# Altium project Motherboard.PrjPcb
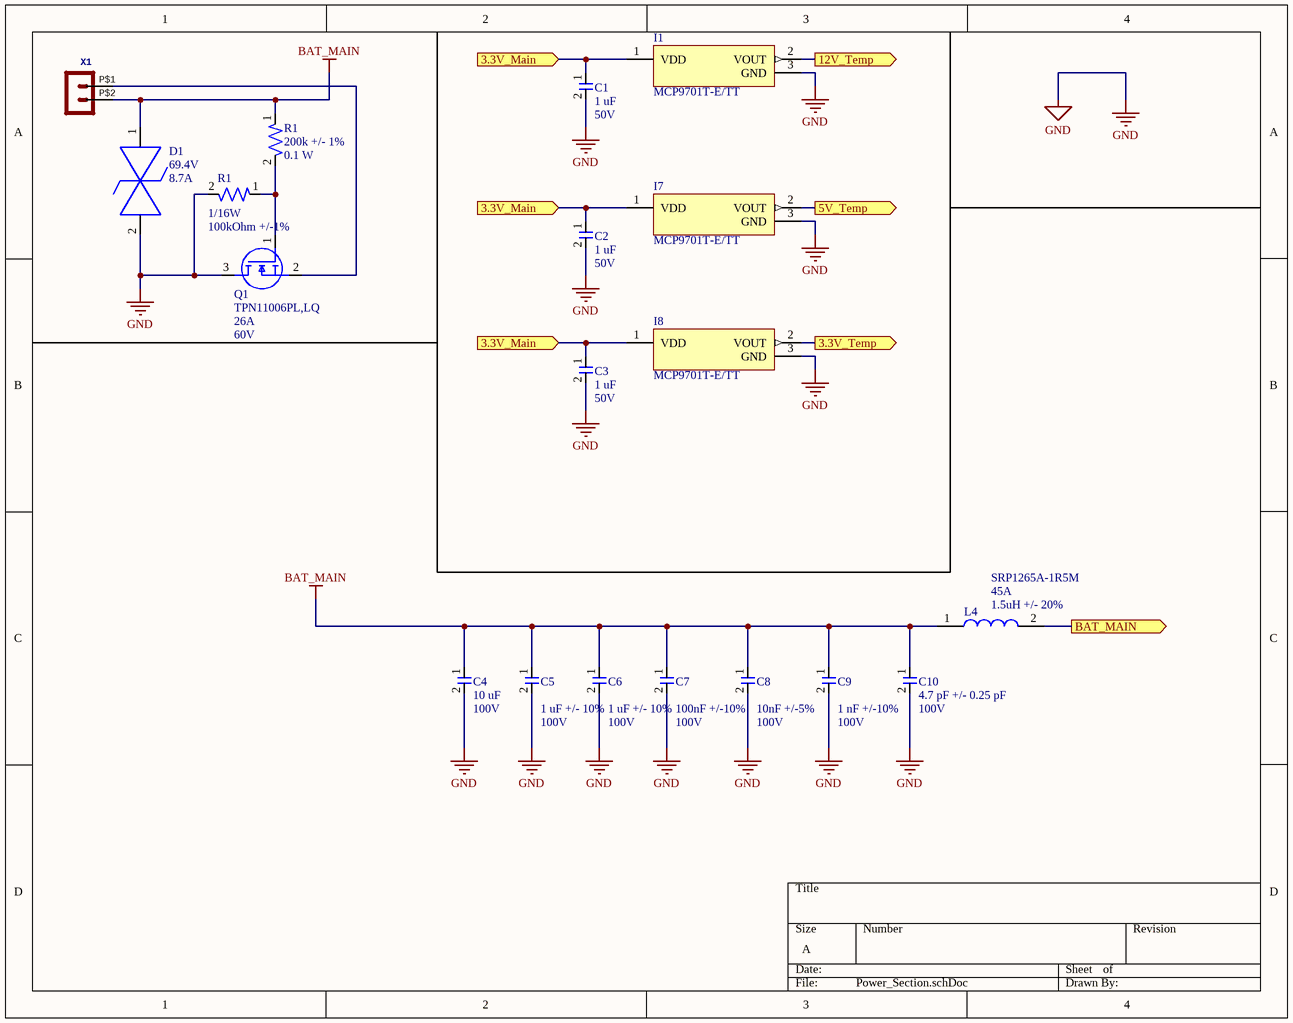
[diagram p0: Power_Section.schDoc]
3 sheets, 151 parts. Net scope: flat (ports and power ports of the same name join across sheets).
Board file: Motherboard.PcbDoc
Sheets:
  Power_Section.schDoc
  5V_12V_Converter.SchDoc
  Mosfet_Board.SchDoc

## Sheet Power_Section.schDoc
size A; SheetNumber: 1; SheetTotal: 8

### Parts
(Parts that share a designator on the sheet are numbered #1, #2 ... from top to bottom, then left to right.)
C1  Capacitance: 1 uF  Voltage: 50V  [CAP-0603]  (hidden comment: UMK107AB7105KA-T)
C2  Capacitance: 1 uF  Voltage: 50V  [CAP-0603]  (hidden comment: UMK107AB7105KA-T)
C3  Capacitance: 1 uF  Voltage: 50V  [CAP-0603]  (hidden comment: UMK107AB7105KA-T)
C4  Capcitance: 10 uF  Voltage Rating: 100V  [CAP-1210]  (hidden comment: GRM32EC72A106KE05L)
C5  Capacitance: 1 uF +/- 10%  Voltage: 100V  [CAP-1206 - duplicate]  (hidden comment: CAP-1U-0001)
C6  Capacitance: 1 uF +/- 10%  Voltage: 100V  [CAP-1206 - duplicate]  (hidden comment: CAP-1U-0001)
C7  Capacitance: 100nF +/-10%  Voltage Rating: 100V  [CAP-0603]  (hidden comment: CC0603KRX7R0BB104)
C8  Capacitance: 10nF +/-5%  Voltage Rating: 100V  [CAP-0603]  (hidden comment: C1608C0G2A103J080AC)
C9  Capacitance: 1 nF +/-10%  Voltage: 100V  [CAP-0603]  (hidden comment: CAP-1N-0001)
C10  Capacitance: 4.7 pF +/- 0.25 pF  Voltage: 100V  [CAP-0603]  (hidden comment: CC0603CRNPO0BN4R7)
D1  Vclamp: 69.4V  Peak pulser current: 8.7A  [DO-214AA (SMBJ)]  (hidden comment: SMBJE43CAH)
I1  MCP9701T-E/TT  [IC-TEMP-0001]
I7  MCP9701T-E/TT  [IC-TEMP-0001]
I8  MCP9701T-E/TT  [IC-TEMP-0001]
L4  SRP1265A-1R5M  Saturation Current: 45A  Inductance: 1.5uH +/- 20%  [PWRIND-1.5U-0002]
Q1  TPN11006PL,LQ  Id-Continuous: 26A  VDS-Max: 60V  [NMOS-8TSON]
R1#1  Resistance: 200k +/- 1%  Power Rating: 0.1 W  [RES-0603]  (hidden comment: ERJ-3EKF2003V)
R1#2  Power Rating: 1/16W  Resistance: 100kOhm +/-1%  [RES-0402]  (hidden comment: AF0402FR-07100KL)
X1  Molex - Micro-Fit 3.0 Series connector,  3.00mm (0.118") pitch header, 2 positions.  [43045-0200]  (value not drawn)

### Ports
3.3V_Main (in), 3.3V_Temp (out), 5V_Temp (out), 12V_Temp (out), BAT_MAIN (out)

### Nets
BAT_MAIN: C4.1 C5.1 C6.1 C7.1 C8.1 C9.1 C10.1 D1.1 L4.1 L4.2 R1#1.1 X1.P$2 ; port BAT_MAIN
GND: C1.2 C2.2 C3.2 C4.2 C5.2 C6.2 C7.2 C8.2 C9.2 C10.2 D1.2 I1.3(GND) I7.3(GND) I8.3(GND) Q1.3(D) R1#2.2
NetC1_1: C1.1 C2.1 C3.1 I1.1(VDD) I7.1(VDD) I8.1(VDD) ; port 3.3V_Main
NetI1_2: I1.2(VOUT) ; port 12V_Temp
NetI7_2: I7.2(VOUT) ; port 5V_Temp
NetI8_2: I8.2(VOUT) ; port 3.3V_Temp
NetQ1_1: Q1.1(G) R1#1.2 R1#2.1
NetQ1_2: Q1.2(S) X1.P$1

### Library data of the parts
C1-C3 = CAP-1U-0002: 1 µF ±10% 50V Ceramic Capacitor X7R 0603 (1608 Metric); Package Size: 0603
C4 = CAP-10U-0003: 10 µF ±10% 100V Ceramic Capacitor X7S 1210 (3225 Metric); Package Size: 1210
C5 C6 = CAP-1U-0001: 1 µF ±10% 100V Ceramic Capacitor X7R 1206 (3216 Metric)
C7 = CAP-100N-0001: CAP CER 0.1UF 100V X7R 0603; Manufacturer: YAGEO; Assembled?: no; Manufacturer Part Number: CC0603KRX7R0BB104; Temperature Coefficient: X7R; Package Size: 0603
C8 = CAP-10N-0002: CAP CER 10000PF 100V C0G 0603; Manufacturer: TDK Corporation; Temperature Coefficient: C0G/NP0; Assembled?: no; Manufacturer Part Number: C1608C0G2A103J080AC; Package Size: 0603
C9 = CAP-1N-0001: 1000 pF ±10% 100V Ceramic Capacitor X7R 0603 (1608 Metric)
C10 = CAP-4.7P-0002: 4.7 pF ±0.25pF 100V Ceramic Capacitor C0G, NP0 0603 (1608 Metric)
D1 = DIO-69.4V-0001: 69.4V Clamp 8.7A Ipp Tvs Diode Surface Mount DO-214AA (SMBJ); Channels: Bidirectional; Breakdown VOltage: 47.8V; Reverse working maximum voltage: 43V; Package: DO-214AA (SMBJ)
I1 I7 I8 = IC-TEMP-0001: Temperature Sensor Analog, Local -10°C ~ 125°C 19.5mV/°C SOT-23-3; Manufacturer: Microchip Technology; Assembled?: no; VCC-Max: 5.5V; VCC-Min: 3.3V; Manufacturer Part Number: MCP9701T-E/TT; Package: SOT-23-3
L4 = PWRIND-1.5U-0002: 1.5 µH Shielded Drum Core, Wirewound Inductor 27 A 3mOhm Max Nonstandard; Manufacturer: Bourns Electronics; Type: DEV; DC Resistnace: 3.0mOhm max; Copyright: Copyright (C) 2022 Ultra Librarian. All rights reserved.; Manufacturer Part Number: SRP1265A-1R5M; Dimensions: 12.5x13.5x6.2
Q1 = NMOS-26A-0001: N-Channel 60 V 26A (Tc) 610mW (Ta), 61W (Tc) Surface Mount 8-TSON Advance (3.1x3.1); Manufacturer: Toshiba; Rds On-Max: 18.1mOhm; Vgs-Max: 20V; Assembled?: no; Manufacturer Part Number: TPN11006PL,LQ; FET type: N-Channel; Package: 8-TSON Advance
R1#1 = RES-200K-0001: 200 kOhms ±1% 0.1W, 1/10W Chip Resistor 0603 (1608 Metric) Automotive AEC-Q200 Thick Film; Manufacturer: Panasonic Electronic Components; Assembled?: Yes; MFP: ERJ-3EKF2003V; Package SIze: 0603
R1#2 = RES-100K-0001: 100 kOhms ±1% 0.063W, 1/16W Chip Resistor 0402 (1005 Metric) Anti-Sulfur, Automotive AEC-Q200 Thick Film; Manufacturer: YAGEO; Assembled?: no; Manufacturer Part Number: AF0402FR-07100KL; Package Size: 0402
X1 = HEADER_POS2_?43045-0200: GateName_1: G$1; SymbolName_1: HEADER_POS2; DeviceName: 43045-0200; LibraryName: con-molex-micro-fit-3_0_2; DeviceSetName: HEADER_POS2_?; Package: 43045-0200

## Sheet 5V_12V_Converter.SchDoc
size B; SheetNumber: 3; SheetTotal: 8
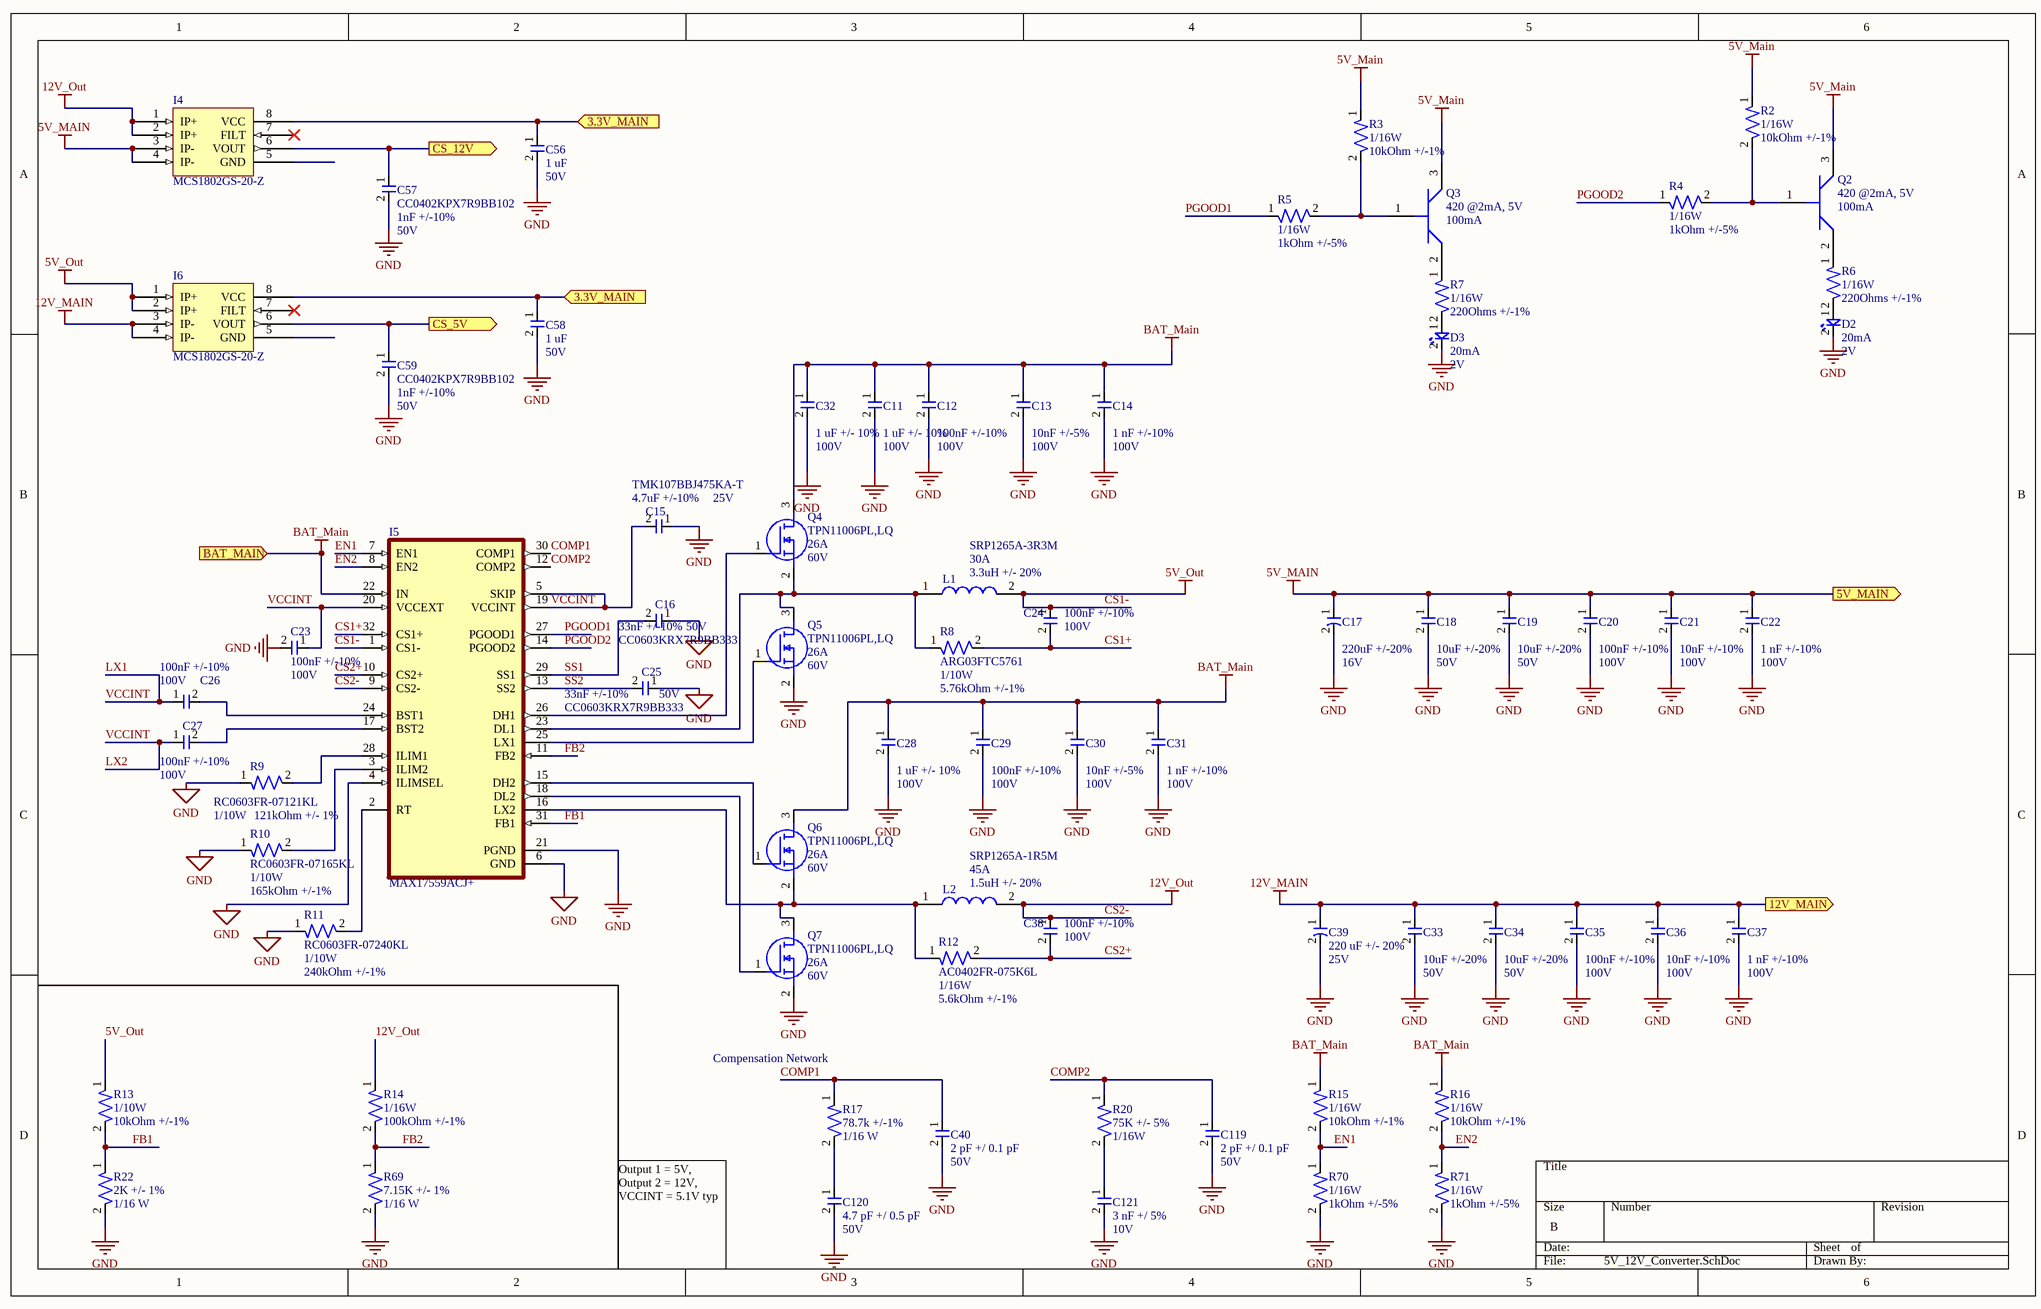
[diagram p1: 5V_12V_Converter.SchDoc]

### Parts
C11  Capacitance: 1 uF +/- 10%  Voltage: 100V  [CAP-1206 - duplicate]  (hidden comment: CAP-1U-0001)
C12  Capacitance: 100nF +/-10%  Voltage Rating: 100V  [CAP-0603]  (hidden comment: CC0603KRX7R0BB104)
C13  Capacitance: 10nF +/-5%  Voltage Rating: 100V  [CAP-0603]  (hidden comment: C1608C0G2A103J080AC)
C14  Capacitance: 1 nF +/-10%  Voltage: 100V  [CAP-0603]  (hidden comment: CAP-1N-0001)
C15  TMK107BBJ475KA-T  Capacitance: 4.7uF +/-10%  Voltage Rating: 25V  [CAP-0603]
C16  CC0603KRX7R9BB333  Capacitance: 33nF +/-10%  Voltage Rating: 50V  [CAP-0603]
C17  Capacitance: 220uF +/-20%  Voltage Rating: 16V  [ELEC-220U-0001]  (hidden comment: UUD1C221MCL1GS)
C18  Capacitance: 10uF +/-20%  Voltage Rating: 50V  [CAP-1206]  (hidden comment: CL31B106KBHNNNE)
C19  Capacitance: 10uF +/-20%  Voltage Rating: 50V  [CAP-1206]  (hidden comment: CL31B106KBHNNNE)
C20  Capacitance: 100nF +/-10%  Voltage Rating: 100V  [CAP-0603]  (hidden comment: CC0603KRX7R0BB104)
C21  Capacitance: 10nF +/-10%  Voltage Rating: 100V  [CAP-0402]  (hidden comment: CC0402KRX7R0BB103)
C22  Capacitance: 1 nF +/-10%  Voltage: 100V  [CAP-0603]  (hidden comment: CAP-1N-0001)
C23  Capacitance: 100nF +/-10%  Voltage Rating: 100V  [CAP-0603]  (hidden comment: CC0603KRX7R0BB104)
C24  Capacitance: 100nF +/-10%  Voltage Rating: 100V  [CAP-0603]  (hidden comment: CC0603KRX7R0BB104)
C25  CC0603KRX7R9BB333  Capacitance: 33nF +/-10%  Voltage Rating: 50V  [CAP-0603]
C26  Capacitance: 100nF +/-10%  Voltage Rating: 100V  [CAP-0603]  (hidden comment: CC0603KRX7R0BB104)
C27  Capacitance: 100nF +/-10%  Voltage Rating: 100V  [CAP-0603]  (hidden comment: CC0603KRX7R0BB104)
C28  Capacitance: 1 uF +/- 10%  Voltage: 100V  [CAP-1206 - duplicate]  (hidden comment: CAP-1U-0001)
C29  Capacitance: 100nF +/-10%  Voltage Rating: 100V  [CAP-0603]  (hidden comment: CC0603KRX7R0BB104)
C30  Capacitance: 10nF +/-5%  Voltage Rating: 100V  [CAP-0603]  (hidden comment: C1608C0G2A103J080AC)
C31  Capacitance: 1 nF +/-10%  Voltage: 100V  [CAP-0603]  (hidden comment: CAP-1N-0001)
C32  Capacitance: 1 uF +/- 10%  Voltage: 100V  [CAP-1206 - duplicate]  (hidden comment: CAP-1U-0001)
C33  Capacitance: 10uF +/-20%  Voltage Rating: 50V  [CAP-1206]  (hidden comment: CL31B106KBHNNNE)
C34  Capacitance: 10uF +/-20%  Voltage Rating: 50V  [CAP-1206]  (hidden comment: CL31B106KBHNNNE)
C35  Capacitance: 100nF +/-10%  Voltage Rating: 100V  [CAP-0603]  (hidden comment: CC0603KRX7R0BB104)
C36  Capacitance: 10nF +/-10%  Voltage Rating: 100V  [CAP-0402]  (hidden comment: CC0402KRX7R0BB103)
C37  Capacitance: 1 nF +/-10%  Voltage: 100V  [CAP-0603]  (hidden comment: CAP-1N-0001)
C38  Capacitance: 100nF +/-10%  Voltage Rating: 100V  [CAP-0603]  (hidden comment: CC0603KRX7R0BB104)
C39  Capacitance: 220 uF +/- 20%  Voltage: 25V  [ELEC-220U-0002]  (hidden comment: 25THV220M8X10.5)
C40  Capacitance: 2 pF +/ 0.1 pF  Voltage: 50V  [CAP-0402]  (hidden comment: CC0402BRNPO9BN2R0)
C56  Capacitance: 1 uF  Voltage: 50V  [CAP-0603]  (hidden comment: UMK107AB7105KA-T)
C57  CC0402KPX7R9BB102  Capacitance: 1nF +/-10%  Voltage Rating: 50V  [CAP-0402]
C58  Capacitance: 1 uF  Voltage: 50V  [CAP-0603]  (hidden comment: UMK107AB7105KA-T)
C59  CC0402KPX7R9BB102  Capacitance: 1nF +/-10%  Voltage Rating: 50V  [CAP-0402]
C119  Capacitance: 2 pF +/ 0.1 pF  Voltage: 50V  [CAP-0402]  (hidden comment: CC0402BRNPO9BN2R0)
C120  Capacitance: 4.7 pF +/ 0.5 pF  Voltage Rating: 50V  [CAP-0603]  (hidden comment: 06035A4R7DAT2A)
C121  Capacitance: 3 nF +/ 5%  Voltagev: 10V  [CAP-0402]  (hidden comment: GRM1557U1A302JA01D)
D2  Current Rating: 20mA  Vf: 2V  [LED-0603]  (hidden comment: 150060AS75000)
D3  Current Rating: 20mA  Vf: 2V  [LED-0603]  (hidden comment: 150060AS75000)
I4  MCS1802GS-20-Z  [IC-BUCK-8SOIC]
I5  MAX17559ACJ+  [IC-BUCK-TQFP-7x7]
I6  MCS1802GS-20-Z  [IC-BUCK-8SOIC]
L1  SRP1265A-3R3M  Saturation Current: 30A  Inductance: 3.3uH +/- 20%  [PWRIND-3.3U-0002]
L2  SRP1265A-1R5M  Saturation Current: 45A  Inductance: 1.5uH +/- 20%  [PWRIND-1.5U-0002]
Q2  hFE: 420 @2mA, 5V  Ic: 100mA  [NPN-420-0001]  (hidden comment: BC847C,235)
Q3  hFE: 420 @2mA, 5V  Ic: 100mA  [NPN-420-0001]  (hidden comment: BC847C,235)
Q4  TPN11006PL,LQ  Id-Continuous: 26A  VDS-Max: 60V  [NMOS-8TSON]
Q5  TPN11006PL,LQ  Id-Continuous: 26A  VDS-Max: 60V  [NMOS-8TSON]
Q6  TPN11006PL,LQ  Id-Continuous: 26A  VDS-Max: 60V  [NMOS-8TSON]
Q7  TPN11006PL,LQ  Id-Continuous: 26A  VDS-Max: 60V  [NMOS-8TSON]
R2  Power Rating: 1/16W  Resistance: 10kOhm +/-1%  [RES-0402]  (hidden comment: RC0402FR-0710KL)
R3  Power Rating: 1/16W  Resistance: 10kOhm +/-1%  [RES-0402]  (hidden comment: RC0402FR-0710KL)
R4  Power Rating: 1/16W  Resistance: 1kOhm +/-5%  [RES-0402]  (hidden comment: RC0402JR-071KP)
R5  Power Rating: 1/16W  Resistance: 1kOhm +/-5%  [RES-0402]  (hidden comment: RC0402JR-071KP)
R6  Power Rating: 1/16W  Resistance: 220Ohms +/-1%  [RES-0402]  (hidden comment: AC0402FR-07220RL)
R7  Power Rating: 1/16W  Resistance: 220Ohms +/-1%  [RES-0402]  (hidden comment: AC0402FR-07220RL)
R8  ARG03FTC5761  Power Rating: 1/10W  Resistance: 5.76kOhm +/-1%  [RES-0603]
R9  RC0603FR-07121KL  Power Rating: 1/10W  Resistance: 121kOhm +/- 1%  [RES-0603]
R10  RC0603FR-07165KL  Power Rating: 1/10W  Resistance: 165kOhm +/-1%  [RES-0603]
R11  RC0603FR-07240KL  Power Rating: 1/10W  Resistance: 240kOhm +/-1%  [RES-0603]
R12  AC0402FR-075K6L  Power Rating: 1/16W  Resistance: 5.6kOhm +/-1%  [RES-0402]
R13  Power Rating: 1/10W  Resistance: 10kOhm +/-1%  [RES-0603]  (hidden comment: RC0603FR-0710KP)
R14  Power Rating: 1/16W  Resistance: 100kOhm +/-1%  [RES-0402]  (hidden comment: AF0402FR-07100KL)
R15  Power Rating: 1/16W  Resistance: 10kOhm +/-1%  [RES-0402]  (hidden comment: RC0402FR-0710KL)
R16  Power Rating: 1/16W  Resistance: 10kOhm +/-1%  [RES-0402]  (hidden comment: RC0402FR-0710KL)
R17  Resistance: 78.7k +/-1%  Power: 1/16 W  [RES-0402]  (hidden comment: RMCF0402FT78K7)
R20  Resistance: 75K +/- 5%  Power: 1/16W  [RES-0402]  (hidden comment: RMCF0402JT75K0)
R22  Resistance: 2K +/- 1%  Power: 1/16 W  [RES-0402]  (hidden comment: RC0402FR-072KP)
R69  Resistance: 7.15K +/- 1%  Power: 1/16 W  [RES-0402]  (hidden comment: CRCW04027K15FKED)
R70  Power Rating: 1/16W  Resistance: 1kOhm +/-5%  [RES-0402]  (hidden comment: RC0402JR-071KP)
R71  Power Rating: 1/16W  Resistance: 1kOhm +/-5%  [RES-0402]  (hidden comment: RC0402JR-071KP)

### Ports
3.3V_MAIN (in), 5V_MAIN (out), 12V_MAIN (out), BAT_MAIN (in), CS_5V (out), CS_12V (out)

### Nets
5V_MAIN: C17.1 C18.1 C19.1 C20.1 C21.1 C22.1 I4.3(IP-) I4.4(IP-) Q2.3 Q3.3 R2.1 R3.1 ; port 5V_MAIN
5V_Out: C24.1 I5.1(CS1-) I6.1(IP+) I6.2(IP+) L1.2 R13.1  [also labelled CS1-]
12V_MAIN: C33.1 C34.1 C35.1 C36.1 C37.1 C39.1 I6.3(IP-) I6.4(IP-) ; port 12V_MAIN
12V_Out: C38.1 I4.1(IP+) I4.2(IP+) I5.9(CS2-) L2.2 R14.1  [also labelled CS2-]
BAT_MAIN: C11.1 C12.1 C13.1 C14.1 C28.1 C29.1 C30.1 C31.1 C32.1 I5.22(IN) Q4.3(D) Q6.3(D) R15.1 R16.1 ; port BAT_MAIN
GND: C11.2 C12.2 C13.2 C14.2 C15.1 C16.1 C17.2 C18.2 C19.2 C20.2 C21.2 C22.2 C23.2 C25.1 C28.2 C29.2 C30.2 C31.2 C32.2 C33.2 C34.2 C35.2 C36.2 C37.2 C39.2 C40.2 C56.2 C57.2 C58.2 C59.2 C119.2 C120.2 C121.2 D2.2 D3.2 I5.4(ILIMSEL) I5.6(GND) I5.21(PGND) Q5.2(S) Q7.2(S) R9.1 R10.1 R11.1 R22.2 R69.2 R70.2 R71.2
COMP1: C40.1 I5.30(COMP1) R17.1
COMP2: C119.1 I5.12(COMP2) R20.1
CS1+: C24.2 I5.32(CS1+) R8.2
CS2+: C38.2 I5.10(CS2+) R12.2
EN1: I5.7(EN1) R15.2 R70.1
EN2: I5.8(EN2) R16.2 R71.1
FB1: I5.31(FB1) R13.2 R22.1
FB2: I5.11(FB2) R14.2 R69.1
LX1: C15.2 C23.1 C26.1 C27.1 I5.5(SKIP) I5.19(VCCINT) I5.20(VCCEXT)  [also labelled LX2, VCCINT]
PGOOD1: I5.27(PGOOD1) R5.1
PGOOD2: I5.14(PGOOD2) R4.1
SS1: C16.2 I5.29(SS1)
SS2: C25.2 I5.13(SS2)
NetC1_1: C56.1 C58.1 I4.8(VCC) I6.8(VCC) ; port 3.3V_MAIN
NetC26_2: C26.2 I5.24(BST1)
NetC27_2: C27.2 I5.17(BST2)
NetC57_1: C57.1 I4.6(VOUT) ; port CS_12V
NetC59_1: C59.1 I6.6(VOUT) ; port CS_5V
NetC120_1: C120.1 R17.2
NetC121_1: C121.1 R20.2
NetD2_1: D2.1 R6.2
NetD3_1: D3.1 R7.2
NetI5_2: I5.2(RT) R11.2
NetI5_3: I5.3(ILIM2) R10.2
NetI5_15: I5.15(DH2) Q6.1(G)
NetI5_16: I5.16(LX2) L2.1 Q6.2(S) Q7.3(D) R12.1
NetI5_18: I5.18(DL2) Q7.1(G)
NetI5_23: I5.23(DL1) L1.1 Q4.2(S) Q5.3(D) R8.1
NetI5_25: I5.25(LX1) Q5.1(G)
NetI5_26: I5.26(DH1) Q4.1(G)
NetI5_28: I5.28(ILIM1) R9.2
NetQ2_1: Q2.1 R2.2 R4.2
NetQ2_2: Q2.2 R6.1
NetQ3_1: Q3.1 R3.2 R5.2
NetQ3_2: Q3.2 R7.1

Not connected (* = marked no-connect by the designer): I4 5(GND) 7(FILT)*; I6 5(GND) 7(FILT)*

### Notes on the sheet
- (near R17) Compensation Network
- Output 1 = 5V,   Output 2 = 12V, VCCINT = 5.1V typ

### Library data of the parts
C11 C28 C32 = CAP-1U-0001: as C5 on sheet Power_Section
C12 C20 C23 C24 C26 C27 C29 C35 C38 = CAP-100N-0001: as C7 on sheet Power_Section; Manufacturer Part Number: CC0603KRX7R0BB104; Temperature Coefficient: X7R; Package Size: 0603
C13 C30 = CAP-10N-0002: as C8 on sheet Power_Section; Manufacturer Part Number: C1608C0G2A103J080AC; Package Size: 0603
C14 C22 C31 C37 = CAP-1N-0001: as C9 on sheet Power_Section
C15 = CAP-4.7U-0001: 4.7 µF ±10% 25V Ceramic Capacitor X5R 0603 (1608 Metric); Manufacturer: Taiyo Yuden; Assembled?: no; Manufacturer Part Number: TMK107BBJ475KA-T; Temperature Coefficient: X5R; Package Size: 0603
C16 C25 = CAP-33N-0001: 0.033 µF ±10% 50V Ceramic Capacitor X7R 0603 (1608 Metric); Manufacturer: YAGEO; Assembled?: no; Manufacturer Part Number: CC0603KRX7R9BB333; Temperature Coefficient: X7R; Package Size: 0603
C17 = ELEC-220U-0001: 220 µF 16 V Aluminum Electrolytic Capacitors Radial, Can - SMD 2000 Hrs @ 105°C; Manufacturer: Nichicon; Assembled?: no; Manufacturer Part Number: UUD1C221MCL1GS
C18 C19 C33 C34 = CAP-10U-0001: 10 µF ±10% 50V Ceramic Capacitor X7R 1206 (3216 Metric); Manufacturer: Samsung Electro-Mechanics; Assembled?: no; Manufacturer Part Number: CL31B106KBHNNNE; Temperature Coefficient: X7R; Package Size: 1206
C21 C36 = CAP-10N-0001: 10000 pF ±10% 100V Ceramic Capacitor X7R 0402 (1005 Metric); Manufacturer: YAGEO; Assembled?: no; Manufacturer Part Number: CC0402KRX7R0BB103; Temperature Coefficient: X7R; Package Size: 0402
C39 = ELEC-220U-0002: 220 µF 25 V Aluminum Electrolytic Capacitors Radial, Can - SMD 300mOhm @ 100kHz 3000 Hrs @ 125°C; SIze: 0.327 in x 0.327 in
C40 C119 = CAP-2P-0001: 2 pF ±0.1pF 50V Ceramic Capacitor C0G, NP0 0402 (1005 Metric)
C56 C58 = CAP-1U-0002: as C1 on sheet Power_Section; Package Size: 0603
C57 C59 = CAP-1N-0002: 1000 pF ±10% 50V Ceramic Capacitor X7R 0402 (1005 Metric); Manufacturer: YAGEO; Assembled?: no; Manufacturer Part Number: CC0402KPX7R9BB102; Temperature Coefficient: X7R; Package Size: 0402
C120 = CAP-4.7P-0001: 4.7 pF ±0.5pF 50V Ceramic Capacitor C0G, NP0 0603 (1608 Metric); Manufacturer: KYOCERA AVX; Temperature Coefficient: G0G. NP0; Assembled?: Yes; Manufacturer Part Number: 06035A4R7DAT2A; Package Size: 0603
C121 = CAP-3N-0001: 3000 pF ±5% 10V Ceramic Capacitor U2J 0402 (1005 Metric)
D2 D3 = LED_Amber_0001: CAP CER 0.1UF 100V X7R 0603; Manufacturer: Wurth Electronik; Assembled?: no; Color: Amber; Manufacturer Part Number: 150060AS75000; Package Size: 0603
I4 I6 = IC-CURRENT-0002: Current Sensor ±20A 1 Channel Hall Effect Bidirectional 8-SOIC (0.154", 3.90mm Width); Manufacturer Part Number: MCS1802GS-20-Z
I5 = IC-BUCK-0005: Buck Regulator Positive Output Step-Down - DC-DC Controller IC 32-TQFP (7x7); MF: Maxim Integrated; SnapEDA_Link: https://www.snapeda.com/parts/MAX17559ACJ+/Maxim+Integrated/view-part/?ref=snap; MP: MAX17559ACJ+; Package: TQFP-32 Maxim; Check_prices: https://www.snapeda.com/parts/MAX17559ACJ+/Maxim+Integrated/view-part/?ref=eda; Value: *; Purchase-URL: https://pricing.snapeda.com/search/part/MAX17559ACJ+/?ref=eda; Digi-Key_Part_Number: MAX17559ACJ+T-ND
L1 = PWRIND-3.3U-0002: 3.3 µH Shielded Drum Core, Wirewound Inductor 18 A 6.8mOhm Max Nonstandard; Manufacturer: Bourns Electronics; Type: DEV; Copyright: Copyright (C) 2022 Ultra Librarian. All rights reserved.; Manufacturer Part Number: SRP1265A-3R3M; Dimensions: 12.5x13.5x6.2; DC Resistance: 6.8mOhm max
L2 = PWRIND-1.5U-0002: as L4 on sheet Power_Section; Copyright: Copyright (C) 2022 Ultra Librarian. All rights reserved.; Manufacturer Part Number: SRP1265A-1R5M; Dimensions: 12.5x13.5x6.2
Q2 Q3 = BJT-420-0001: Bipolar (BJT) Transistor NPN 45 V 100 mA 100MHz 250 mW Surface Mount TO-236AB; VCEO: 45V; Transistor type: NPN; Package: TO-236AB
Q4-Q7 = NMOS-26A-0001: as Q1 on sheet Power_Section; Manufacturer Part Number: TPN11006PL,LQ; FET type: N-Channel; Package: 8-TSON Advance
R2 R3 R15 R16 = RES-10K-0001: RES 10K OHM 1% 1/16W 0402; Manufacturer: YAGEO; Assembled?: no; Manufacturer Part Number: RC0402FR-0710KL; Package Size: 0402
R4 R5 R70 R71 = RES-1K-0001: RES SMD 1K OHM 5% 1/16W 0402; Manufacturer: YAGEO; Assembled?: no; Manufacturer Part Number: RC0402JR-071KP; Package Size: 0402
R6 R7 = RES-220-0001: 220 Ohms ±1% 0.063W, 1/16W Chip Resistor 0402 (1005 Metric) Automotive AEC-Q200, Moisture Resistant Thick Film; Manufacturer: YAGEO; Assembled?: no; Manufacturer Part Number: AC0402FR-07220RL; Package Size: 0402
R8 = RES-5.76K-0001: 100mW Thin Film Resistor 75V ±25ppm/℃ ±1% -55℃~+155℃ 5.76kΩ 0603 Chip Resistor - Surface Mount ROHS; Manufacturer: Viking Tech; Assembled?: no; Manufacturer Part Number: ARG03FTC5761; Package Size: 0603
R9 = RES-121K-0001: 121k Ohms ±1% 0.1W, 1/10W Chip Resistor 0603 (1608 Metric) Moisture Resistant Thick Film; Manufacturer: YAGEO; Assembled?: no; Manufacturer Part Number: RC0603FR-07121KL; Package Size: 0603
R10 = RES-165K-0001: 165k Ohms ±1% 0.1W, 1/10W Chip Resistor 0603 (1608 Metric) Moisture Resistant Thick Film; Manufacturer: YAGEO; Assembled?: no; Manufacturer Part Number: RC0603FR-07165KL; Package Size: 0603
R11 = RES-240K-0001: 240k Ohms ±1% 0.1W, 1/10W Chip Resistor 0603 (1608 Metric) Moisture Resistant Thick Film; Manufacturer: YAGEO; Assembled?: no; Manufacturer Part Number: RC0603FR-07240KL; Package Size: 0603
R12 = RES-5.6K-0001: 5.6 kOhms ±1% 0.063W, 1/16W Chip Resistor 0402 (1005 Metric) Automotive AEC-Q200, Moisture Resistant Thick Film; Manufacturer: YAGEO; Assembled?: no; Manufacturer Part Number: AC0402FR-075K6L; Package Size: 0402
R13 = RES-10K-0002: RES SMD 10K OHM 1% 1/10W 0603; Manufacturer: YAGEO; Assembled?: no; Manufacturer Part Number: RC0603FR-0710KP; Package Size: 0603
R14 = RES-100K-0001: as R1#2 on sheet Power_Section; Manufacturer Part Number: AF0402FR-07100KL; Package Size: 0402
R17 = RES-78.7K-0001: 78.7 kOhms ±1% 0.063W, 1/16W Chip Resistor 0402 (1005 Metric) Automotive AEC-Q200 Thick Film
R20 = RES-75K-0001: 75 kOhms ±5% 0.063W, 1/16W Chip Resistor 0402 (1005 Metric) Automotive AEC-Q200 Thick Film
R22 = RES-2K-0001: 2 kOhms ±1% 0.063W, 1/16W Chip Resistor 0402 (1005 Metric) Thick Film
R69 = RES-7K-0001: 7.15 kOhms ±1% 0.063W, 1/16W Chip Resistor 0402 (1005 Metric) Automotive AEC-Q200 Thick Film

## Sheet Mosfet_Board.SchDoc
size A4; SheetNumber: 5; SheetTotal: 8
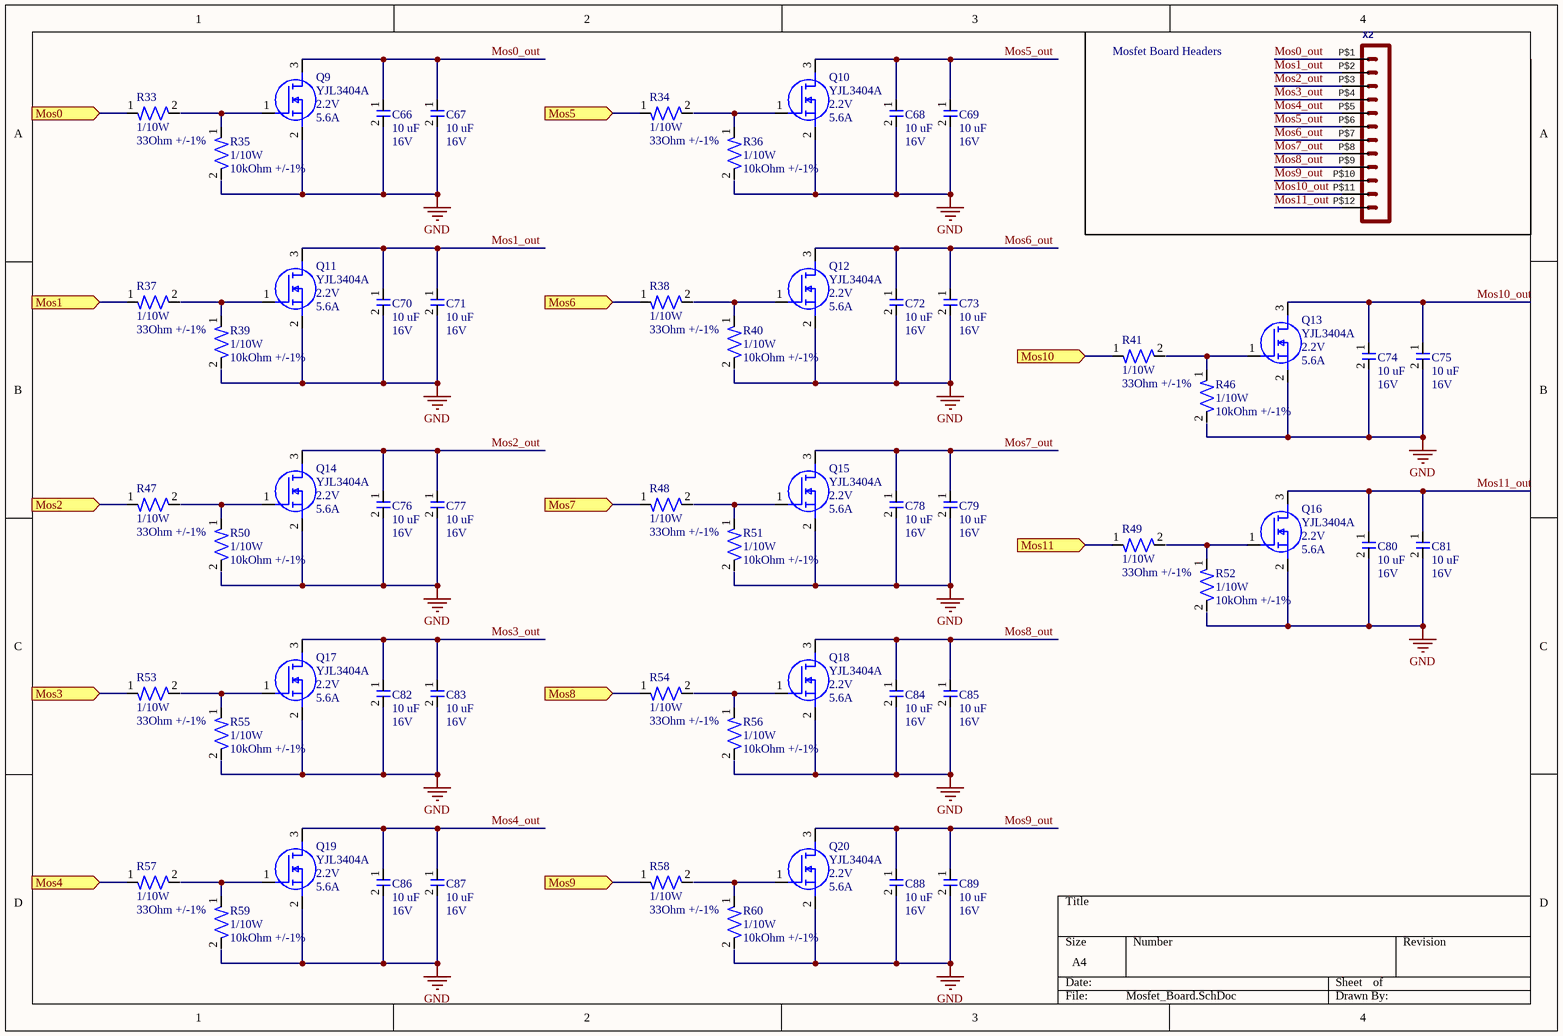
[diagram p2: Mosfet_Board.SchDoc]

### Parts
C66  Capacitance: 10 uF  Voltage Rating: 16V  [CAP-0805]  (hidden comment: MCS1802GS-20-Z)
C67  Capacitance: 10 uF  Voltage Rating: 16V  [CAP-0805]  (hidden comment: MCS1802GS-20-Z)
C68  Capacitance: 10 uF  Voltage Rating: 16V  [CAP-0805]  (hidden comment: MCS1802GS-20-Z)
C69  Capacitance: 10 uF  Voltage Rating: 16V  [CAP-0805]  (hidden comment: MCS1802GS-20-Z)
C70  Capacitance: 10 uF  Voltage Rating: 16V  [CAP-0805]  (hidden comment: MCS1802GS-20-Z)
C71  Capacitance: 10 uF  Voltage Rating: 16V  [CAP-0805]  (hidden comment: MCS1802GS-20-Z)
C72  Capacitance: 10 uF  Voltage Rating: 16V  [CAP-0805]  (hidden comment: MCS1802GS-20-Z)
C73  Capacitance: 10 uF  Voltage Rating: 16V  [CAP-0805]  (hidden comment: MCS1802GS-20-Z)
C74  Capacitance: 10 uF  Voltage Rating: 16V  [CAP-0805]  (hidden comment: MCS1802GS-20-Z)
C75  Capacitance: 10 uF  Voltage Rating: 16V  [CAP-0805]  (hidden comment: MCS1802GS-20-Z)
C76  Capacitance: 10 uF  Voltage Rating: 16V  [CAP-0805]  (hidden comment: MCS1802GS-20-Z)
C77  Capacitance: 10 uF  Voltage Rating: 16V  [CAP-0805]  (hidden comment: MCS1802GS-20-Z)
C78  Capacitance: 10 uF  Voltage Rating: 16V  [CAP-0805]  (hidden comment: MCS1802GS-20-Z)
C79  Capacitance: 10 uF  Voltage Rating: 16V  [CAP-0805]  (hidden comment: MCS1802GS-20-Z)
C80  Capacitance: 10 uF  Voltage Rating: 16V  [CAP-0805]  (hidden comment: MCS1802GS-20-Z)
C81  Capacitance: 10 uF  Voltage Rating: 16V  [CAP-0805]  (hidden comment: MCS1802GS-20-Z)
C82  Capacitance: 10 uF  Voltage Rating: 16V  [CAP-0805]  (hidden comment: MCS1802GS-20-Z)
C83  Capacitance: 10 uF  Voltage Rating: 16V  [CAP-0805]  (hidden comment: MCS1802GS-20-Z)
C84  Capacitance: 10 uF  Voltage Rating: 16V  [CAP-0805]  (hidden comment: MCS1802GS-20-Z)
C85  Capacitance: 10 uF  Voltage Rating: 16V  [CAP-0805]  (hidden comment: MCS1802GS-20-Z)
C86  Capacitance: 10 uF  Voltage Rating: 16V  [CAP-0805]  (hidden comment: MCS1802GS-20-Z)
C87  Capacitance: 10 uF  Voltage Rating: 16V  [CAP-0805]  (hidden comment: MCS1802GS-20-Z)
C88  Capacitance: 10 uF  Voltage Rating: 16V  [CAP-0805]  (hidden comment: MCS1802GS-20-Z)
C89  Capacitance: 10 uF  Voltage Rating: 16V  [CAP-0805]  (hidden comment: MCS1802GS-20-Z)
Q9  YJL3404A  Vgs(th): 2.2V  Drain Current: 5.6A  [NMOS-SOT23-3]
Q10  YJL3404A  Vgs(th): 2.2V  Drain Current: 5.6A  [NMOS-SOT23-3]
Q11  YJL3404A  Vgs(th): 2.2V  Drain Current: 5.6A  [NMOS-SOT23-3]
Q12  YJL3404A  Vgs(th): 2.2V  Drain Current: 5.6A  [NMOS-SOT23-3]
Q13  YJL3404A  Vgs(th): 2.2V  Drain Current: 5.6A  [NMOS-SOT23-3]
Q14  YJL3404A  Vgs(th): 2.2V  Drain Current: 5.6A  [NMOS-SOT23-3]
Q15  YJL3404A  Vgs(th): 2.2V  Drain Current: 5.6A  [NMOS-SOT23-3]
Q16  YJL3404A  Vgs(th): 2.2V  Drain Current: 5.6A  [NMOS-SOT23-3]
Q17  YJL3404A  Vgs(th): 2.2V  Drain Current: 5.6A  [NMOS-SOT23-3]
Q18  YJL3404A  Vgs(th): 2.2V  Drain Current: 5.6A  [NMOS-SOT23-3]
Q19  YJL3404A  Vgs(th): 2.2V  Drain Current: 5.6A  [NMOS-SOT23-3]
Q20  YJL3404A  Vgs(th): 2.2V  Drain Current: 5.6A  [NMOS-SOT23-3]
R33  Power Rating: 1/10W  Resistance: 33Ohm +/-1%  [RES-0603]  (hidden comment: RC0603FR-0733RP)
R34  Power Rating: 1/10W  Resistance: 33Ohm +/-1%  [RES-0603]  (hidden comment: RC0603FR-0733RP)
R35  Power Rating: 1/10W  Resistance: 10kOhm +/-1%  [RES-0603]  (hidden comment: RC0603FR-0710KP)
R36  Power Rating: 1/10W  Resistance: 10kOhm +/-1%  [RES-0603]  (hidden comment: RC0603FR-0710KP)
R37  Power Rating: 1/10W  Resistance: 33Ohm +/-1%  [RES-0603]  (hidden comment: RC0603FR-0733RP)
R38  Power Rating: 1/10W  Resistance: 33Ohm +/-1%  [RES-0603]  (hidden comment: RC0603FR-0733RP)
R39  Power Rating: 1/10W  Resistance: 10kOhm +/-1%  [RES-0603]  (hidden comment: RC0603FR-0710KP)
R40  Power Rating: 1/10W  Resistance: 10kOhm +/-1%  [RES-0603]  (hidden comment: RC0603FR-0710KP)
R41  Power Rating: 1/10W  Resistance: 33Ohm +/-1%  [RES-0603]  (hidden comment: RC0603FR-0733RP)
R46  Power Rating: 1/10W  Resistance: 10kOhm +/-1%  [RES-0603]  (hidden comment: RC0603FR-0710KP)
R47  Power Rating: 1/10W  Resistance: 33Ohm +/-1%  [RES-0603]  (hidden comment: RC0603FR-0733RP)
R48  Power Rating: 1/10W  Resistance: 33Ohm +/-1%  [RES-0603]  (hidden comment: RC0603FR-0733RP)
R49  Power Rating: 1/10W  Resistance: 33Ohm +/-1%  [RES-0603]  (hidden comment: RC0603FR-0733RP)
R50  Power Rating: 1/10W  Resistance: 10kOhm +/-1%  [RES-0603]  (hidden comment: RC0603FR-0710KP)
R51  Power Rating: 1/10W  Resistance: 10kOhm +/-1%  [RES-0603]  (hidden comment: RC0603FR-0710KP)
R52  Power Rating: 1/10W  Resistance: 10kOhm +/-1%  [RES-0603]  (hidden comment: RC0603FR-0710KP)
R53  Power Rating: 1/10W  Resistance: 33Ohm +/-1%  [RES-0603]  (hidden comment: RC0603FR-0733RP)
R54  Power Rating: 1/10W  Resistance: 33Ohm +/-1%  [RES-0603]  (hidden comment: RC0603FR-0733RP)
R55  Power Rating: 1/10W  Resistance: 10kOhm +/-1%  [RES-0603]  (hidden comment: RC0603FR-0710KP)
R56  Power Rating: 1/10W  Resistance: 10kOhm +/-1%  [RES-0603]  (hidden comment: RC0603FR-0710KP)
R57  Power Rating: 1/10W  Resistance: 33Ohm +/-1%  [RES-0603]  (hidden comment: RC0603FR-0733RP)
R58  Power Rating: 1/10W  Resistance: 33Ohm +/-1%  [RES-0603]  (hidden comment: RC0603FR-0733RP)
R59  Power Rating: 1/10W  Resistance: 10kOhm +/-1%  [RES-0603]  (hidden comment: RC0603FR-0710KP)
R60  Power Rating: 1/10W  Resistance: 10kOhm +/-1%  [RES-0603]  (hidden comment: RC0603FR-0710KP)
X2  Molex - Micro-Fit 3.0 Series connector,  3.00mm (0.118") pitch header, 12 positions.  [44764-1201]  (value not drawn)

### Ports
Mos0 (in), Mos1 (in), Mos2 (in), Mos3 (in), Mos4 (in), Mos5 (in), Mos6 (in), Mos7 (in), Mos8 (in), Mos9 (in), Mos10 (in), Mos11 (in)

### Nets
GND: C66.2 C67.2 C68.2 C69.2 C70.2 C71.2 C72.2 C73.2 C74.2 C75.2 C76.2 C77.2 C78.2 C79.2 C80.2 C81.2 C82.2 C83.2 C84.2 C85.2 C86.2 C87.2 C88.2 C89.2 Q9.2(S) Q10.2(S) Q11.2(S) Q12.2(S) Q13.2(S) Q14.2(S) Q15.2(S) Q16.2(S) Q17.2(S) Q18.2(S) Q19.2(S) Q20.2(S)
Mos0_out: C66.1 C67.1 Q9.3(D) X2.P$1
Mos1_out: C70.1 C71.1 Q11.3(D) X2.P$2
Mos2_out: C76.1 C77.1 Q14.3(D) X2.P$3
Mos3_out: C82.1 C83.1 Q17.3(D) X2.P$4
Mos4_out: C86.1 C87.1 Q19.3(D) X2.P$5
Mos5_out: C68.1 C69.1 Q10.3(D) X2.P$6
Mos6_out: C72.1 C73.1 Q12.3(D) X2.P$7
Mos7_out: C78.1 C79.1 Q15.3(D) X2.P$8
Mos8_out: C84.1 C85.1 Q18.3(D) X2.P$9
Mos9_out: C88.1 C89.1 Q20.3(D) X2.P$10
Mos10_out: C74.1 C75.1 Q13.3(D) X2.P$11
Mos11_out: C80.1 C81.1 Q16.3(D) X2.P$12
NetQ9_1: Q9.1(G) R35.1
NetQ10_1: Q10.1(G) R36.1
NetQ11_1: Q11.1(G) R39.1
NetQ12_1: Q12.1(G) R40.1
NetQ13_1: Q13.1(G) R46.1
NetQ14_1: Q14.1(G) R50.1
NetQ15_1: Q15.1(G) R51.1
NetQ16_1: Q16.1(G) R52.1
NetQ17_1: Q17.1(G) R55.1
NetQ18_1: Q18.1(G) R56.1
NetQ19_1: Q19.1(G) R59.1
NetQ20_1: Q20.1(G) R60.1
NetR33_1: R33.1 ; port Mos0
NetR34_1: R34.1 ; port Mos5
NetR37_1: R37.1 ; port Mos1
NetR38_1: R38.1 ; port Mos6
NetR41_1: R41.1 ; port Mos10
NetR47_1: R47.1 ; port Mos2
NetR48_1: R48.1 ; port Mos7
NetR49_1: R49.1 ; port Mos11
NetR53_1: R53.1 ; port Mos3
NetR54_1: R54.1 ; port Mos8
NetR57_1: R57.1 ; port Mos4
NetR58_1: R58.1 ; port Mos9

Not connected (* = marked no-connect by the designer): R33 2; R34 2; R35 2; R36 2; R37 2; R38 2; R39 2; R40 2; R41 2; R46 2; R47 2; R48 2; R49 2; R50 2; R51 2; R52 2; R53 2; R54 2; R55 2; R56 2; R57 2; R58 2; R59 2; R60 2

### Notes on the sheet
- Mosfet Board Headers

### Library data of the parts
C66-C89 = CAP-10U-0002: 10 µF ±10% 16V Ceramic Capacitor X7R 0805 (2012 Metric); Package Size: 0805
Q9-Q20 = NMOS-5.6A-0001: N-Channel 30 V 5.6A (Ta) 1.2W (Ta) Surface Mount SOT-23; Vdss: 30V; Rds On: 24 mOhm; Manufacturer Part Number: YJL3404A; Package Size: SOT23
R33 R34 R37 R38 R41 R47-R49 R53 R54 R57 R58 = RES-33-0002: RES SMD 33 OHM 1% 1/10W 0603; Manufacturer: YAGEO; Assembled?: no; Manufacturer Part Number: RC0603FR-0733RP; Package Size: 0603
R35 R36 R39 R40 R46 R50-R52 R55 R56 R59 R60 = RES-10K-0002: as R13 on sheet 5V_12V_Converter; Manufacturer Part Number: RC0603FR-0710KP; Package Size: 0603
X2 = HEADER_POS12_?44764-1201: GateName_1: G$1; SymbolName_1: HEADER_POS12; DeviceName: 44764-1201; LibraryName: con-molex-micro-fit-3_0_2; DeviceSetName: HEADER_POS12_?; Package: 44764-1201

## Nets that join several sheets
BAT_MAIN: Power_Section (12 pins), 5V_12V_Converter (14 pins)
GND: Power_Section (16 pins), 5V_12V_Converter (47 pins), Mosfet_Board (36 pins)
NetC1_1: Power_Section (6 pins), 5V_12V_Converter (C56.1 C58.1 I4.8 I6.8)